# EAGLE schematic Smart Garden (EAGLE 9.5.1)

## Sheet 1 of 2
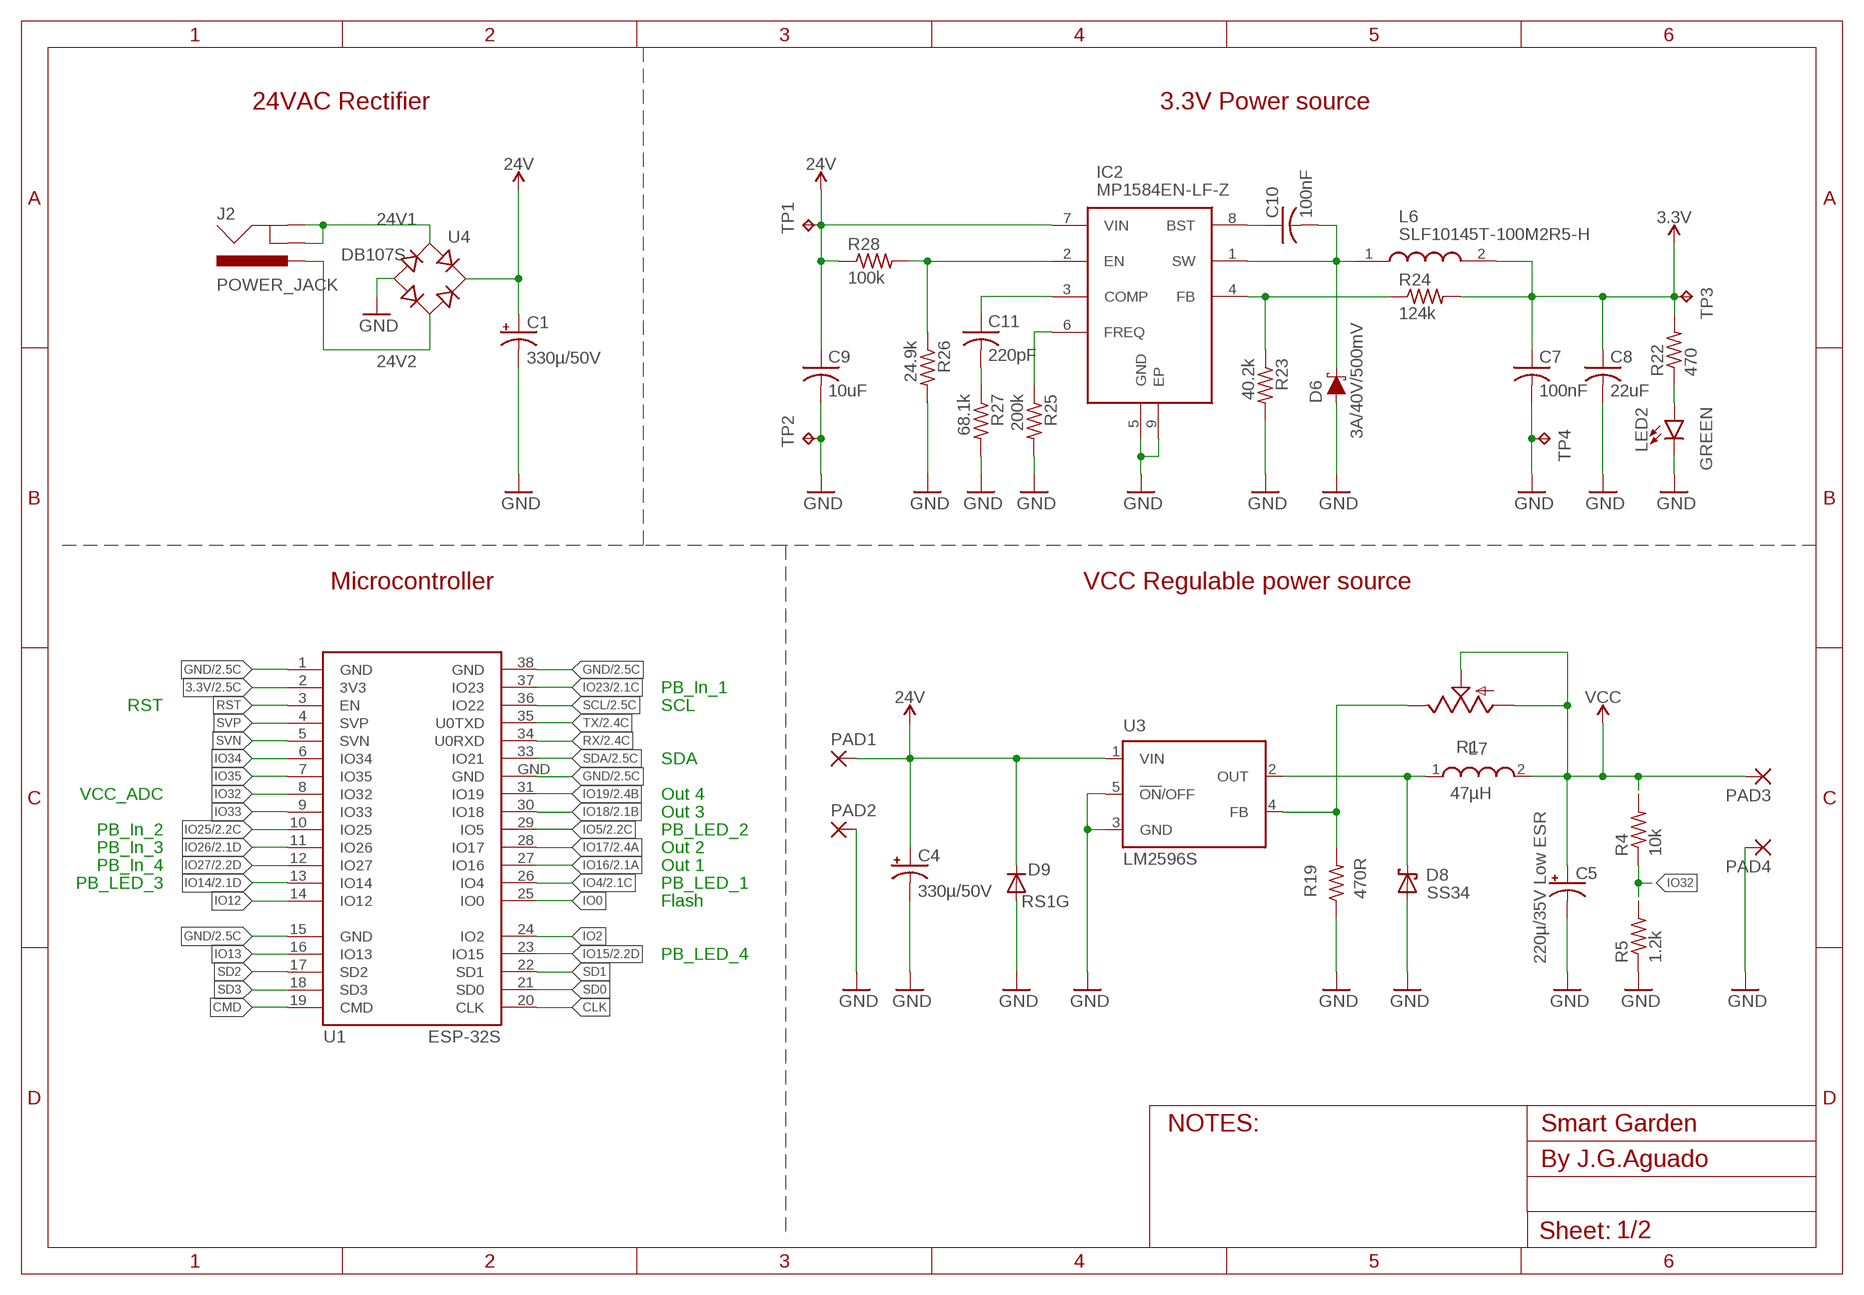
[diagram p0: schematic, sheet 1]

### Parts
C1  330µ/50V  CPOL-USG  [PANASONIC_G]
C4  330µ/50V  CPOL-USG  [PANASONIC_G]
C5  220µ/35V Low ESR  CPOL-USF  [PANASONIC_F]
C7  100nF  C-USC0603  [C0603]
C8  22uF  C-USC0603  [C0603]
C9  10uF  C-USC0603  [C0603]
C10  100nF  C-USC0603  [C0603]
C11  220pF  C-USC0603  [C0603]
D6  3A/40V/500mV  DIODE-SCHOTTKY-B340A  [SMA-DIODE]
D8  SS34  SCHOTTKY-DIODESMD  [SMB]
D9  RS1G  DIODE-DO214AC  [DO214AC]
IC2  MP1584EN-LF-Z  [SOIC127P600X170-9N]
J2  POWER_JACK  [POWER_JACK_PTH]
L6  SLF10145T-100M2R5-H  [SLF10145]
L7  47µH  WE-PD_1260/1245/1280/1210  [WE-PD_1260/1245/1280/1210]
LED2  GREEN  LED-GREEN0603  [LED-0603]
PAD1  2,54/1,1  [2,54/1,1]
PAD2  2,54/1,1  [2,54/1,1]
PAD3  2,54/1,1  [2,54/1,1]
PAD4  2,54/1,1  [2,54/1,1]
R1  TRIM_US-RJ9W  [RJ9W]
R4  10k  R-US_R0603  [R0603]
R5  1.2k  R-US_R0603  [R0603]
R19  470R  R-US_R1206  [R1206]
R22  470  R-US_R0603  [R0603]
R23  40.2k  R-US_R0603  [R0603]
R24  124k  R-US_R0603  [R0603]
R25  200k  R-US_R0603  [R0603]
R26  24.9k  R-US_R0603  [R0603]
R27  68.1k  R-US_R0603  [R0603]
R28  100k  R-US_R0603  [R0603]
TP1  TPTP20SQ  [TP20SQ]
TP2  TPTP20SQ  [TP20SQ]
TP3  TPTP20SQ  [TP20SQ]
TP4  TPTP20SQ  [TP20SQ]
U1  ESP-32S  [ESP-32S]
U3  LM2596S  [TO263-5]
U4  DB107S  DBS107G  [DBS]

### Nets
3.3V: C7.1 C8.1 L6.2 R22.2 R24.2 TP3.TP U1.2(3V3) ; also sheet 2
24V: C1.+ C4.+ C9.1 D9.C IC2.7(VIN) PAD1.1(P) R28.1 TP1.TP U3.1(VIN) U4.+
24V1: J2.GND J2.GNDBREAK U4.AC1 ; also sheet 2
24V2: J2.PWR U4.AC2 ; also sheet 2
CLK: U1.20(CLK)
CMD: U1.19(CMD)
GND: C1.- C4.- C5.- C7.2 C8.2 C9.2 D6.A D8.A D9.A IC2.5(GND) IC2.9(EP) LED2.C PAD2.1(P) PAD4.1(P) R5.1 R19.1 R23.2 R25.2 R26.2 R27.2 TP2.TP TP4.TP U1.1(GND) U1.15(GND) U1.38(GND) U1.GND U3.3(GND) U3.5(!ON!/OFF) U4.- ; also sheet 2
IO0: U1.25(IO0) ; also sheet 2
IO2: U1.24(IO2)
IO4: U1.26(IO4) ; also sheet 2
IO5: U1.29(IO5) ; also sheet 2
IO12: U1.14(IO12)
IO13: U1.16(IO13)
IO14: U1.13(IO14) ; also sheet 2
IO15: U1.23(IO15) ; also sheet 2
IO16: U1.27(IO16) ; also sheet 2
IO17: U1.28(IO17) ; also sheet 2
IO18: U1.30(IO18) ; also sheet 2
IO19: U1.31(IO19) ; also sheet 2
IO23: U1.37(IO23) ; also sheet 2
IO25: U1.10(IO25) ; also sheet 2
IO26: U1.11(IO26) ; also sheet 2
IO27: U1.12(IO27) ; also sheet 2
IO32: R4.1 R5.2 U1.8(IO32)
IO33: U1.9(IO33)
IO34: U1.6(IO34)
IO35: U1.7(IO35)
N$14: D8.C L7.1 U3.2(OUT)
N$18: R1.E R19.2 U3.4(FB)
N$33: LED2.A R22.1
N$34: C10.1 IC2.8(BST)
N$35: C10.2 D6.C IC2.1(SW) L6.1
N$36: IC2.4(FB) R23.1 R24.1
N$37: C11.2 R27.1
N$38: C11.1 IC2.3(COMP)
N$39: IC2.6(FREQ) R25.1
N$40: IC2.2(EN) R26.1 R28.2
RST: U1.3(EN) ; also sheet 2
RX: U1.34(U0RXD) ; also sheet 2
SCL: U1.36(IO22) ; also sheet 2
SD0: U1.21(SD0)
SD1: U1.22(SD1)
SD2: U1.17(SD2)
SD3: U1.18(SD3)
SDA: U1.33(IO21) ; also sheet 2
SVN: U1.5(SVN)
SVP: U1.4(SVP)
TX: U1.35(U0TXD) ; also sheet 2
VCC: C5.+ L7.2 PAD3.1(P) R1.A R1.S R4.2 ; also sheet 2

### Notes on the sheet
- 24VAC Rectifier | 3.3V Power source
- Microcontroller | VCC Regulable power source
- PB_In_1
- RST | SCL
- SDA
- VCC_ADC | Out 4
- Out 3
- PB_In_2 | PB_LED_2
- PB_In_3 | Out 2
- PB_In_4 | Out 1
- PB_LED_3 | PB_LED_1
- Flash
- PB_LED_4

## Sheet 2 of 2
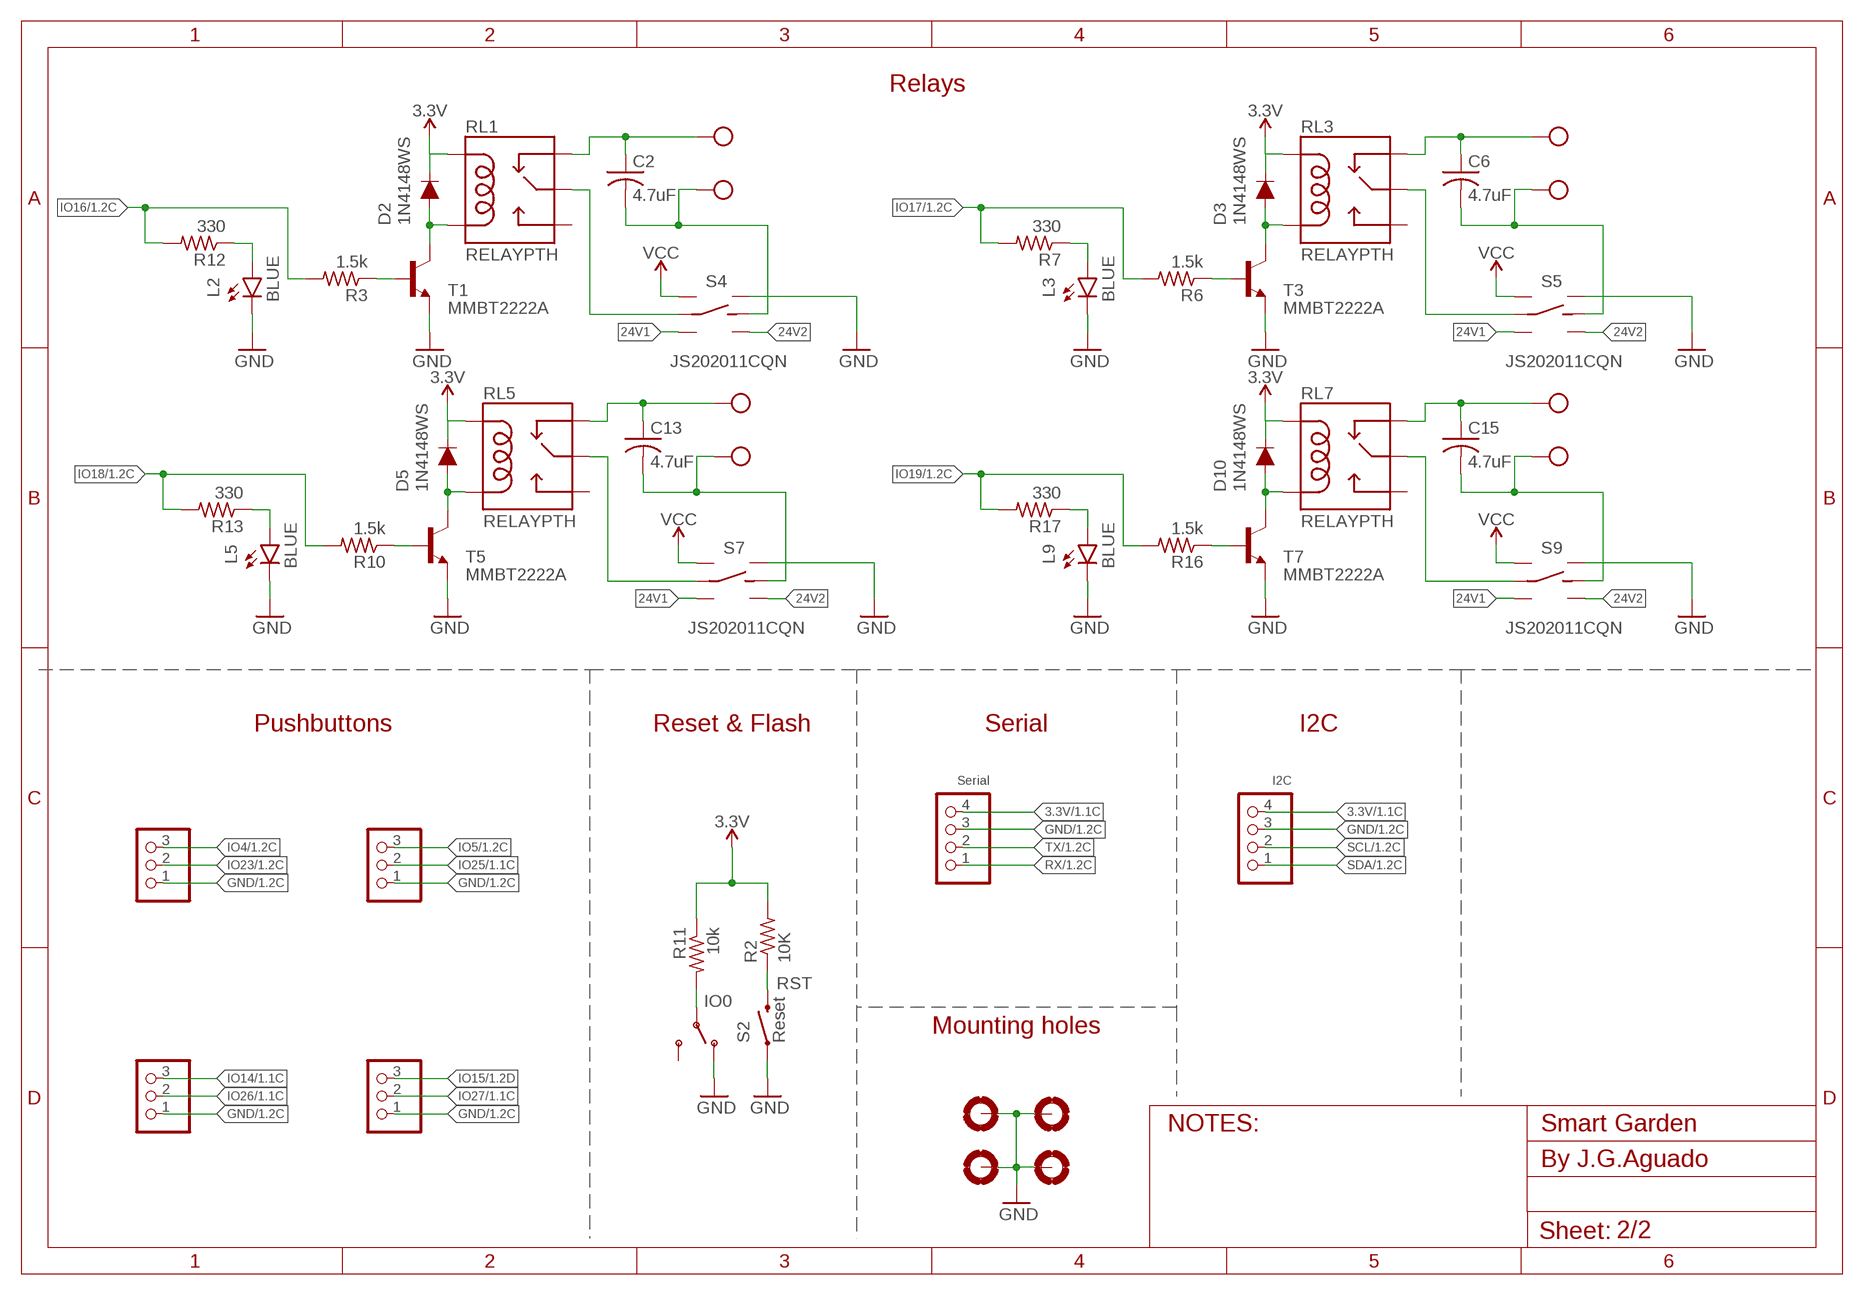
[diagram p1: schematic, sheet 2]

### Parts
C2  4.7uF  C-USC1206  [C1206]
C6  4.7uF  C-USC1206  [C1206]
C13  4.7uF  C-USC1206  [C1206]
C15  4.7uF  C-USC1206  [C1206]
D2  1N4148WS  DIODE-BAS16J  [SOD-323]
D3  1N4148WS  DIODE-BAS16J  [SOD-323]
D5  1N4148WS  DIODE-BAS16J  [SOD-323]
D10  1N4148WS  DIODE-BAS16J  [SOD-323]
H1  MOUNT-PAD-ROUND  [3,0-PAD]
H2  MOUNT-PAD-ROUND  [3,0-PAD]
H3  MOUNT-PAD-ROUND  [3,0-PAD]
H4  MOUNT-PAD-ROUND  [3,0-PAD]
JP1  Serial  PINHD-1X4  [1X04]
JP2  PINHD-1X3  [1X03]
JP3  PINHD-1X3  [1X03]
JP4  PINHD-1X3  [1X03]
JP5  PINHD-1X3  [1X03]
JP6  I2C  PINHD-1X4  [1X04]
L2  BLUE  LED-BLUE0603  [LED-0603]
L3  BLUE  LED-BLUE0603  [LED-0603]
L5  BLUE  LED-BLUE0603  [LED-0603]
L9  BLUE  LED-BLUE0603  [LED-0603]
R2  10K  R-US_R0603  [R0603]
R3  1.5k  R-US_R0603  [R0603]
R6  1.5k  R-US_R0603  [R0603]
R7  330  R-US_R0603  [R0603]
R10  1.5k  R-US_R0603  [R0603]
R11  10k  R-US_R0603  [R0603]
R12  330  R-US_R0603  [R0603]
R13  330  R-US_R0603  [R0603]
R16  1.5k  R-US_R0603  [R0603]
R17  330  R-US_R0603  [R0603]
RL1  RELAYPTH  [SRD-05VDC-SL-C]
RL3  RELAYPTH  [SRD-05VDC-SL-C]
RL5  RELAYPTH  [SRD-05VDC-SL-C]
RL7  RELAYPTH  [SRD-05VDC-SL-C]
S1  SWITCH_SPDT  [KPS-1290]
S2  Reset  SWITCH-MOMENTARY-2SMD-4  [TACTILE_SWITCH_TALL]
S4  JS202011CQN  DPDT_JS202011CQN  [DPDT_JS202011CQN]
S5  JS202011CQN  DPDT_JS202011CQN  [DPDT_JS202011CQN]
S7  JS202011CQN  DPDT_JS202011CQN  [DPDT_JS202011CQN]
S9  JS202011CQN  DPDT_JS202011CQN  [DPDT_JS202011CQN]
T1  MMBT2222A  BC847  [SOT23]
T3  MMBT2222A  BC847  [SOT23]
T5  MMBT2222A  BC847  [SOT23]
T7  MMBT2222A  BC847  [SOT23]
X2  W237-102  [W237-102]
X4  W237-102  [W237-102]
X6  W237-102  [W237-102]
X7  W237-102  [W237-102]

### Nets
3.3V: D2.C D3.C D5.C D10.C JP1.4 JP6.4 R2.2 R11.1 RL1.COIL1 RL3.COIL1 RL5.COIL1 RL7.COIL1 ; also sheet 1
24V1: S4.3(L2) S5.3(L2) S7.3(L2) S9.3(L2) ; also sheet 1
24V2: S4.6(R2) S5.6(R2) S7.6(R2) S9.6(R2) ; also sheet 1
GND: H1.B3,0(MOUNT) H1.P$2(MOUNT) H1.P$3(MOUNT) H1.P$4(MOUNT) H1.P$5(MOUNT) H1.P$6(MOUNT) H1.P$7(MOUNT) H1.P$8(MOUNT) H1.P$9(MOUNT) H2.B3,0(MOUNT) H2.P$2(MOUNT) H2.P$3(MOUNT) H2.P$4(MOUNT) H2.P$5(MOUNT) H2.P$6(MOUNT) H2.P$7(MOUNT) H2.P$8(MOUNT) H2.P$9(MOUNT) H3.B3,0(MOUNT) H3.P$2(MOUNT) H3.P$3(MOUNT) H3.P$4(MOUNT) H3.P$5(MOUNT) H3.P$6(MOUNT) H3.P$7(MOUNT) H3.P$8(MOUNT) H3.P$9(MOUNT) H4.B3,0(MOUNT) H4.P$2(MOUNT) H4.P$3(MOUNT) H4.P$4(MOUNT) H4.P$5(MOUNT) H4.P$6(MOUNT) H4.P$7(MOUNT) H4.P$8(MOUNT) H4.P$9(MOUNT) JP1.3 JP2.1 JP3.1 JP4.1 JP5.1 JP6.3 L2.C L3.C L5.C L9.C S1.O S2.A2 S4.4(R1) S5.4(R1) S7.4(R1) S9.4(R1) T1.2(E) T3.2(E) T5.2(E) T7.2(E) ; also sheet 1
IO0: R11.2 S1.P ; also sheet 1
IO4: JP5.3 ; also sheet 1
IO5: JP4.3 ; also sheet 1
IO14: JP3.3 ; also sheet 1
IO15: JP2.3 ; also sheet 1
IO16: R3.2 R12.2 ; also sheet 1
IO17: R6.2 R7.2 ; also sheet 1
IO18: R10.2 R13.2 ; also sheet 1
IO19: R16.2 R17.2 ; also sheet 1
IO23: JP5.2 ; also sheet 1
IO25: JP4.2 ; also sheet 1
IO26: JP3.2 ; also sheet 1
IO27: JP2.2 ; also sheet 1
N$1: RL1.SWCOMMON S4.2(LC)
N$2: C2.2 S4.5(RC) X7.2
N$3: C2.1 RL1.SWCLOSED(SWCLOSE) X7.1
N$7: D2.A RL1.COIL0 T1.3(C)
N$9: R3.1 T1.1(B)
N$12: D3.A RL3.COIL0 T3.3(C)
N$13: R6.1 T3.1(B)
N$15: L3.A R7.1
N$16: RL3.SWCOMMON S5.2(LC)
N$17: C6.2 S5.5(RC) X2.2
N$19: C6.1 RL3.SWCLOSED(SWCLOSE) X2.1
N$23: L2.A R12.1
N$27: D5.A RL5.COIL0 T5.3(C)
N$28: R10.1 T5.1(B)
N$29: L5.A R13.1
N$30: RL5.SWCOMMON S7.2(LC)
N$31: C13.2 S7.5(RC) X4.2
N$32: C13.1 RL5.SWCLOSED(SWCLOSE) X4.1
N$47: D10.A RL7.COIL0 T7.3(C)
N$48: R16.1 T7.1(B)
N$49: L9.A R17.1
N$50: RL7.SWCOMMON S9.2(LC)
N$51: C15.2 S9.5(RC) X6.2
N$52: C15.1 RL7.SWCLOSED(SWCLOSE) X6.1
RST: R2.1 S2.B2 ; also sheet 1
RX: JP1.1 ; also sheet 1
SCL: JP6.2 ; also sheet 1
SDA: JP6.1 ; also sheet 1
TX: JP1.2 ; also sheet 1
VCC: S4.1(L1) S5.1(L1) S7.1(L1) S9.1(L1) ; also sheet 1
Unconnected: RL1.SWOPEN RL3.SWOPEN RL5.SWOPEN RL7.SWOPEN S1.S

### Notes on the sheet
- Relays
- Pushbuttons | Reset & Flash | Serial | I2C
- Mounting holes

## Library data of the parts
C1 C4 = rcl:CPOL-US: POLARIZED CAPACITOR, American symbol; MF: Panasonic; MFN: EEVFK1H221P; SPICEPREFIX: C
C2 C6 C13 C15 = rcl:C-US: CAPACITOR, American symbol; LCSC: C29823; SPICEPREFIX: C
C5 = rcl:CPOL-US: POLARIZED CAPACITOR, American symbol; MF: Panasonic; MFN: EINTRAGEN!; SPICEPREFIX: C
C7-C11 = rcl:C-US: CAPACITOR, American symbol; SPICEPREFIX: C
D2 D3 D5 D10 = SparkFun-DiscreteSemi:DIODE: Diode These are standard reverse protection diodes and small signal diodes. SparkFun Products: SparkFun SparkPunk Sound Kit <https://www.sparkfun.com/products/11177> SparkFun ESP8266 Thing <https://www.sparkfun.com/products/13231>; PROD_ID: DIO-09646; VALUE: 250mA/100V
D6 = SparkFun-DiscreteSemi:DIODE-SCHOTTKY: Schottky diode A Schottky diode is a semiconductor diode which has a low forward voltage drop and a very fast switching action.; PROD_ID: DIO-09886
D8 = diode:SCHOTTKY-DIODE: Schottky Diode
D9 = diode:DIODE-: DIODE; MF: multicomp; MFN: RS1G; OC_FARNELL: 4085035
H1-H4 = SpaceDIY_connectors:MOUNT-PAD-ROUND: MOUNTING PAD, round
IC2 = SamacSys_Parts:MP1584EN-LF-Z: Switching Voltage Regulators 3A 1.5MHz 28V Nonsync Buck Source: Datasheet <https://componentsearchengine.com/Datasheets/1/MP1584EN-LF-Z.pdf>; DESCRIPTION: Switching Voltage Regulators 3A 1.5MHz 28V Nonsync Buck; HEIGHT: 1.7mm; MANUFACTURER_NAME: Monolithic Power Systems (MPS); MANUFACTURER_PART_NUMBER: MP1584EN-LF-Z; MOUSER_PART_NUMBER: 946-MP1584ENLFZ; MOUSER_PRICE-STOCK: https://www.mouser.co.uk/ProductDetail/Monolithic-Power-Systems-MPS/MP1584EN-LF-Z?qs=rC7bBWoQAAktQUA%2FYI26vA%3D%3D
J2 = SparkFun-Connectors:POWER_JACK: Power Jack Connector This is the standard 5.5mm barrel jack for power. The PTH is the most common, proven, reliable, footprint. The Slot footprint only works if the mill layer is transmitted to the PCB fab house so be warned. Here are the connectors we sell at SparkFun: DC Barrel Power Jack/Connector <https://www.sparkfun.com/products/119> (PRT-00119) DC Barrel Power Jack/Connector (SMD) <https://www.sparkfun.com/products/12748> (PRT-12748) DC Barrel Jack Adapter - Breadboard Compatible <https://www.sparkfun.com/products/10811> (PRT-10811) It is used on this SparkFun product (and many, many others): SparkFun RedBoard - Programmed with Arduino <https://www.sparkfun.com/products/12757> (DEV-12757) Also, if you need a mating power supply or connector, please check these out: Wall Adapter Power Supply - 9VDC 650mA <https://www.sparkfun.com/products/298> (TOL-00298) DC Barrel Jack Adapter - Male <https://www.sparkfun.com/products/10287> (PRT-10287); PROD_ID: CONN-08197
JP1 JP6 = SpaceDIY_connectors:PINHD-1X4: PIN HEADER
JP2-JP5 = adafruit:PINHD-1X3: PIN HEADER
L2 L3 L5 L9 = SparkFun-LED:LED-BLUE: Blue SMD LED Used in manufacturing of various products at SparkFun Packages: 0603 - SMD 0603 package [Product Link] <http://www.digikey.com/product-detail/en/SMLE12BC7TT86/511-1589-2-ND/1641808> 1206 - SMD1206 package [Product Link] <http://www.digikey.com/product-detail/en/lite-on-inc/LTST-C150TBKT/160-1643-1-ND/573584> SparkFun Products: ESP8266 Thing-Dev Board <https://www.sparkfun.com/products/13711> RedBoard <https://www.sparkfun.com/products/12757>; PROD_ID: DIO-08575
L6 = SamacSys_Parts:SLF10145T-100M2R5-H: Inductors for power circuits, Wound ferrite, Automotive Source: Datasheet <https://product.tdk.com/system/files/dam/doc/product/inductor/inductor/smd/catalog/inductor_automotive_power_slf10145-h_en.pdf>; DESCRIPTION: Inductors for power circuits, Wound ferrite, Automotive; HEIGHT: mm; MANUFACTURER_NAME: TDK; MANUFACTURER_PART_NUMBER: SLF10145T-100M2R5-H; MOUSER_PART_NUMBER: 810-SLF10145T100M2R5; MOUSER_PRICE-STOCK: https://www.mouser.co.uk/ProductDetail/TDK/SLF10145T-100M2R5-H?qs=Ydpp5fRLlSHtCO7lbZYIxA%3D%3D
L7 = Wurth_Elektronik_Passive_rev15b:WE-PD: SMD Shielded Power Inductor Characteristics Magnetically shielded version which results in a low leakage field High Saturation currents up to 25 A Very low self-losses at high switching frequency‘s Wide inductances spectrum available at all sizes Operating temperature: –40 °C to +125 °C Applications Perfectly suitable for switching regulators with extremely high efficiency Integrated DC/DC- converter Switching regulators with low operating voltages (Graphic cards, embedded PC-Cards, Mainboards) Plastic base: Because of the one piece construction these are more suitable for high vibration or shock applications <http://katalog.we-online.de/media/images/eisos/FePBF_pf2.jpg> Details see: http://katalog.we-online.de/en/pbs/WE-PD? Updated by Dan Xu 2014-07-08 2014 (C) Wurth Elektronik; MF: Wuerth
LED2 = SparkFun-LED:LED-GREEN: Green SMD LED Used in manufacturing of various products at SparkFun Packages: 0603 - SMD 0603 package [Product Link] <http://www.futureelectronics.com/en/technologies/semiconductors/optoelectronics/leds/Pages/9894312-LTST-C190GKT.aspx?CrossPart=HSMG-C190&IM=0> LilyPad 1206 - SMD1206 LilyPad package [Product Link] <http://www.futureelectronics.com/en/Technologies/Product.aspx?ProductID=IN150NGHARVATEKCORPORATION2049943&IM=0> 1206 - SMD1206 package [Product Link] <http://www.futureelectronics.com/en/technologies/semiconductors/optoelectronics/leds/Pages/8315665-LTST-C150KGKT.aspx?IM=0> 1206 Bottom Mount -SMD 1206 Bottom Mount [Product Link] <http://www.digikey.com/product-detail/en/lite-on-inc/LTST-C230KGKT/160-1456-1-ND/386854> SparkFun Products: Pro Mini 328 -5V <https://www.sparkfun.com/products/821> RedBoard <https://www.sparkfun.com/products/12757> MP3 Trigger <https://www.sparkfun.com/products/13720> Makey Makey <https://www.sparkfun.com/products/11076>; LCSC: C72043; PROD_ID: DIO-00821
PAD1-PAD4 = wirepad:2,54/1,1: THROUGH-HOLE PAD
R1 = pot:TRIM_US-: POTENTIOMETER
R2 R4 R11 = rcl:R-US_: RESISTOR, American symbol; LCSC: C25804; SPICEPREFIX: R
R3 R6 R10 R16 = rcl:R-US_: RESISTOR, American symbol; LCSC: C22843; SPICEPREFIX: R
R5 R7 R12 R13 R17 R19 R22-R28 = rcl:R-US_: RESISTOR, American symbol; SPICEPREFIX: R
RL1 RL3 RL5 RL7 = SpaceDIY_actuators:RELAY: SPDT relay (COM-00101)
S1 = SparkFun-Retired:SWITCH_SPDT: SWCH-10651 Side-actuated SPDT slide switch, as used on the Arduino Pro; PROD_ID: SWCH-10651
S2 = Testing:SWITCH-MOMENTARY-2: Various NO switches- pushbuttons, reed, etc
S4 S5 S7 S9 = bt_electromech:DPDT: Dual Position, Dual Throw (DPDT) Switch
T1 T3 T5 T7 = transistor:BC847: NPN TRANSISTOR; LCSC: C8512
TP1-TP4 = testpad:TP: Test pad
U1 = esp32:ESP-32S: Ai-Thinker ESP-32S
U3 = national-semiconductor:LM2596: SIMPLE SWITCHER® Power Converter 150 kHz 3A Step-Down Voltage Regulator Source: http://www.national.com/ds/LM/LM2596.pdf; MF: NATIONAL SEMICONDUCTOR; MPN: LM2596S-ADJ/NOPB; OC_FARNELL: 9494367; OC_NEWARK: 41K3842
U4 = rectifier:DB?*G: Single Phase 1.0 AMP Glass Passivated Bridge Rectifier Taiwan Semiconductor Co.,Ltd. - TSC Source: http://www.taiwansemi.com/TSCbig5/ezcatfiles/cust/img/img/db101g.pdf http://www.ts.com.tw/db/pictures/modules/PDT/PDT060207001/DBLS201G.pdf; LCSC: C5377
X2 X4 X6 X7 = con-wago-500:W237-102: WAGO SCREW CLAMP; MPN: 237-102; OC_FARNELL: unknown; OC_NEWARK: 70K9898